# Altium schematic sheet CURRENT_SOURCE.SchDoc
size 420 x 297 mm; SheetNumber: 5; SheetTotal: 6
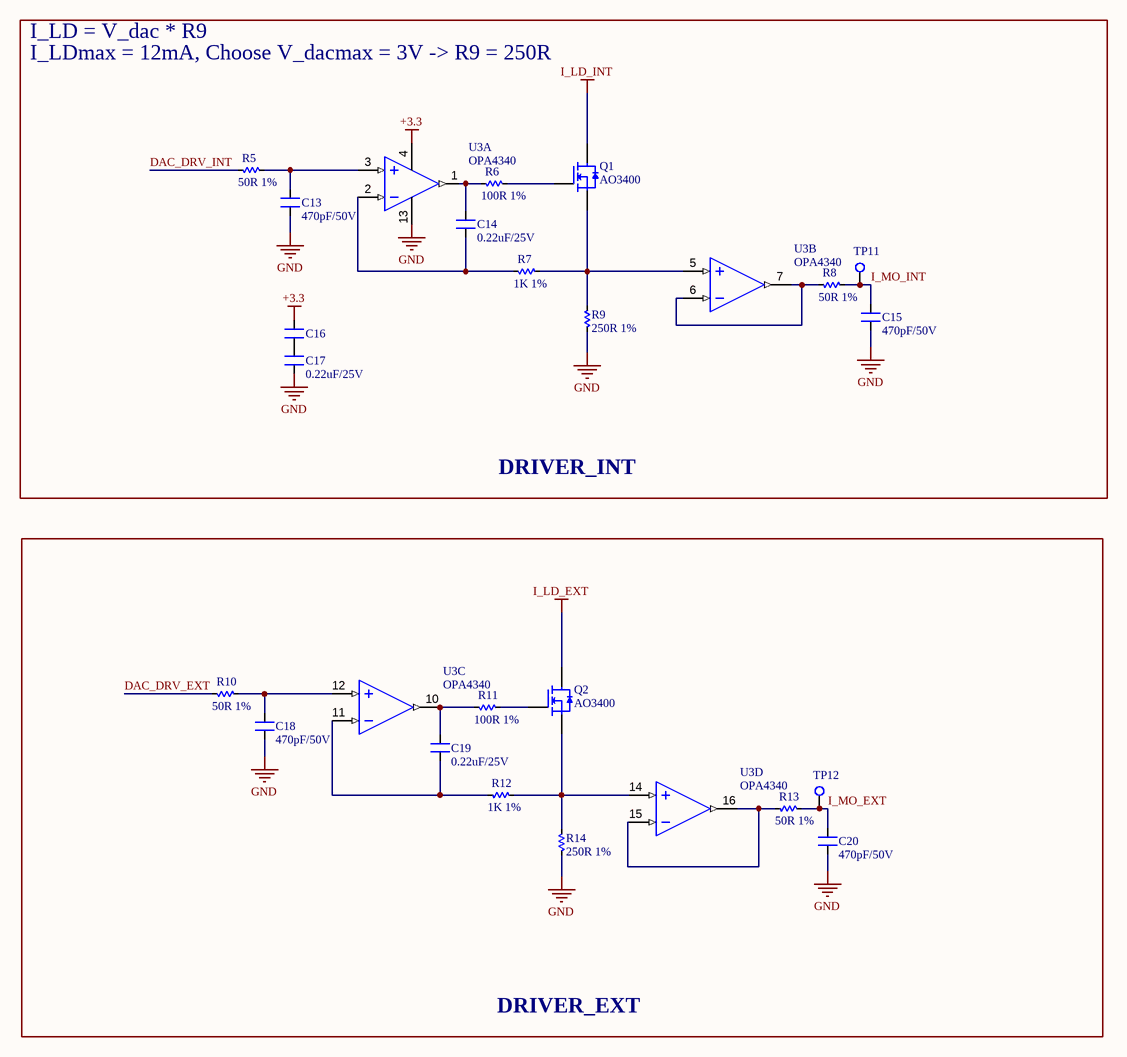
[diagram p0: CURRENT_SOURCE.SchDoc]

## Parts
C13  470pF/50V  [SM-0603]
C14  0.22uF/25V  [SM-0603]
C15  470pF/50V  [SM-0603]
C16  0.22uF/25V  [SM-0603]  (value not drawn)
C17  0.22uF/25V  [SM-0603]
C18  470pF/50V  [SM-0603]
C19  0.22uF/25V  [SM-0603]
C20  470pF/50V  [SM-0603]
Q1  AO3400  [SOT23-132]
Q2  AO3400  [SOT23-132]
R5  50R 1%  [RES-SMD-0603]
R6  100R 1%  [RES-SMD-0603]
R7  1K 1%  [RES-SMD-0603]
R8  50R 1%  [RES-SMD-0603]
R9  250R 1%  [RES-SMD-1206]
R10  50R 1%  [RES-SMD-0603]
R11  100R 1%  [RES-SMD-0603]
R12  1K 1%  [RES-SMD-0603]
R13  50R 1%  [RES-SMD-0603]
R14  250R 1%  [RES-SMD-1206]
TP11  Test_Point  [TESTPOINT]  (value not drawn)
TP12  Test_Point  [TESTPOINT]  (value not drawn)
U3  OPA4340  [SSOP16]  (parts A,B,C,D of 4)

## Blocks framed on the sheet
DRIVER_EXT: C18-C20 Q2 R10-R14 TP12 U3

## Nets
+3.3: C16.2 U3.4(+V)
GND: C13.1 C15.1 C17.1 C18.1 C20.1 R9.1 R14.1 U3.13(-V)
I_LD_EXT: Q2.3
I_LD_INT: Q1.3
DAC_DRV_EXT: R10.1
DAC_DRV_INT: R5.1
I_MO_EXT: C20.2 R13.2 TP12.1
I_MO_INT: C15.2 R8.2 TP11.1
NetC13_2: C13.2 R5.2 U3.3(IN+)
NetC14_1: C14.1 R7.1 U3.2(IN-)
NetC14_2: C14.2 R6.1 U3.1(OUT)
NetC16_1: C16.1 C17.2
NetC18_2: C18.2 R10.2 U3.12(IN+)
NetC19_1: C19.1 R12.1 U3.11(IN-)
NetC19_2: C19.2 R11.1 U3.10(OUT)
NetQ1_1: Q1.1 R6.2
NetQ1_2: Q1.2 R7.2 R9.2 U3.5(IN+)
NetQ2_1: Q2.1 R11.2
NetQ2_2: Q2.2 R12.2 R14.2 U3.14(IN+)
NetR8_1: R8.1 U3.6(IN-) U3.7(OUT)
NetR13_1: R13.1 U3.15(IN-) U3.16(OUT)

## Notes on the sheet
- I_LD = V_dac * R9
- I_LDmax = 12mA, Choose V_dacmax = 3V -> R9 = 250R
- DRIVER_INT
- Project:
- BEE-PC1
- Sub-system:
- Design by:
- Hung Nguyen D.
- Bao Bui Q.
- Sheet title:
- Sheet
- A3
- of
- Checked by:
- Approved by:
- Vu Pham
- Revision:
- Document No:
- V1.2.0
- Size:
- Date:

## Library data of the parts
C13-C20 = CM: 0603; Value: 103
Q1 Q2 = FET-N
R5-R8 R10-R14 = Res-SMD: 0603; Manufacturer: Generic Components; Class: Passive; Published: 08/06/2000; Publisher: Altium Hobart Technology Centre
R9 = Res-SMD: 1206; Manufacturer: Generic Components; Class: Passive; Published: 08/06/2000; Publisher: Altium Hobart Technology Centre
U3 = OPA4340: IC CMOS 4 CIRCUIT 16SSOP; Supplier 1: Mouser; Supplier Part Number 1: 595-OPA4340UA/2K5